# EAGLE design 0132-ledz-8 (EAGLE 9.6.2)
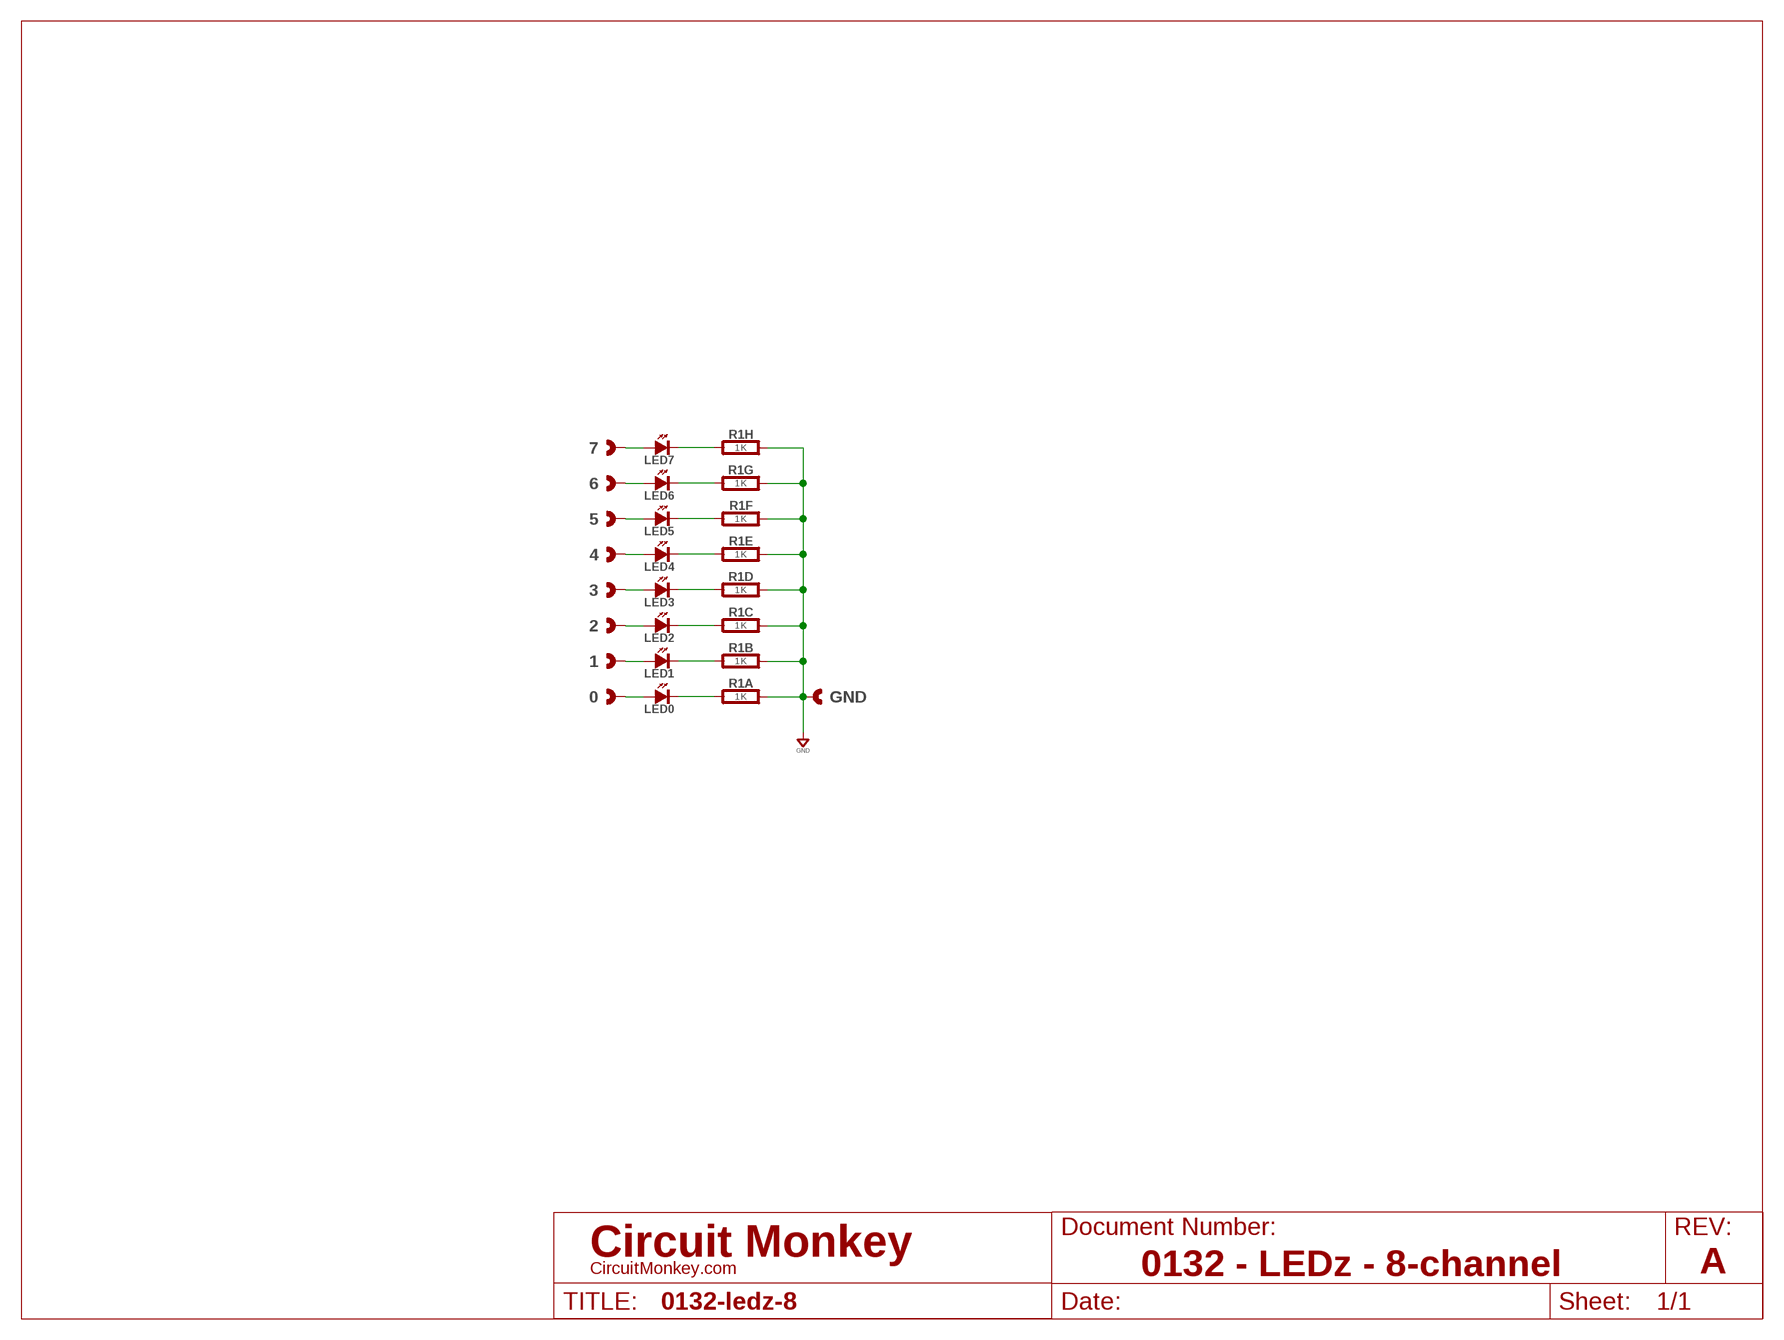
[diagram p0: schematic, sheet 1]
SHEET1 (LETTER_L-CIRCUITMONKEY): DOCUMENT_NUMBER: 0132 - LEDz - 8-channel; REV: A

## Parts
0  CAST-01X12.00MM  [CAST01-2.00MM]
1  CAST-01X12.00MM  [CAST01-2.00MM]
2  CAST-01X12.00MM  [CAST01-2.00MM]
3  CAST-01X12.00MM  [CAST01-2.00MM]
4  CAST-01X12.00MM  [CAST01-2.00MM]
5  CAST-01X12.00MM  [CAST01-2.00MM]
6  CAST-01X12.00MM  [CAST01-2.00MM]
7  CAST-01X12.00MM  [CAST01-2.00MM]
GND  CAST-01X12.00MM  [CAST01-2.00MM]
LED0  SMT0603  [SMD_0603]
LED1  SMT0603  [SMD_0603]
LED2  SMT0603  [SMD_0603]
LED3  SMT0603  [SMD_0603]
LED4  SMT0603  [SMD_0603]
LED5  SMT0603  [SMD_0603]
LED6  SMT0603  [SMD_0603]
LED7  SMT0603  [SMD_0603]
R1  1K  RESNET_0402_INDIV_X8CTS  [RESNET_0402_X8]

## Nets
GND: GND.1 GND.P$1 GND.P$2 R1.1 R1.2 R1.3 R1.4 R1.5 R1.6 R1.7 R1.8
LED0: 0.1 0.P$1 0.P$2 LED0.A
LED1: 1.1 1.P$1 1.P$2 LED1.A
LED2: 2.1 2.P$1 2.P$2 LED2.A
LED3: 3.1 3.P$1 3.P$2 LED3.A
LED4: 4.1 4.P$1 4.P$2 LED4.A
LED5: 5.1 5.P$1 5.P$2 LED5.A
LED6: 6.1 6.P$1 6.P$2 LED6.A
LED7: 7.1 7.P$1 7.P$2 LED7.A
N$1: LED0.K(C) R1.16
N$2: LED1.K(C) R1.15
N$3: LED2.K(C) R1.14
N$4: LED3.K(C) R1.13
N$5: LED4.K(C) R1.12
N$6: LED5.K(C) R1.11
N$7: LED6.K(C) R1.10
N$8: LED7.K(C) R1.9

## Library data of the parts
0 1-7 GND = con-headers:CAST-01X1: Castelated Edge Hole Pad
LED0 LED1-LED7 = led:SMT: LED SMT; COST01: 0.20; COST10: 0.17; COST100: 0.14
R1 = rlc:RESNET_0402_INDIV_X8: Resnet - Network Eight Individual Resistors.; COST01: 0.50; COST10: 0.20; COST100: 0.14; MFR: CTS; MPN: 741X163xxx

## Board
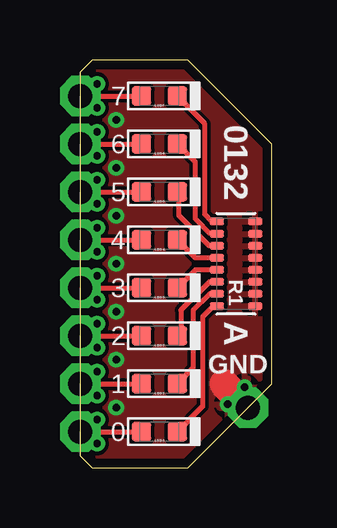
[diagram p1: board, top side]
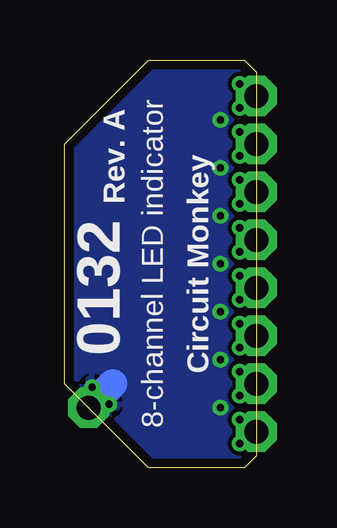
[diagram p2: board, bottom side, seen from below]

Size 8 x 17 mm. Coordinates in mm from the lower left corner, seen from the top.
Outline: 0,0.5 0.5,0 4.5,0 8,3.5 8,13.5 4.5,17 0.5,17 0,16.5 0,0.5
Copper layers (1*16): Top 0.0712mm / dielectric 0.657mm / Bottom 0.0712mm
Design rules "OSH-CircuitMonkey-thin": minimum track width 6mil, minimum drill 12mil, track to track 6mil, track to pad 6mil, pad to pad 6mil, via to via 6mil, smd to smd 6mil, copper to edge 15mil, drill to drill 6mil, minimum pad ring 7mil, minimum via ring 7mil, stop-mask expansion 3mil, vias tented up to drill 14mil, thermal gap 10mil

### Footprints (pad centres in the part's own frame; a part is rotated, then mirrored left to right if it is on the bottom)
CAST01-2.00MM = drill 1 pad 1.7 octagon: 1 0,0 | drill 0.305: P$1 -0.7,0.5; P$2 -0.7,-0.5
SMD_0603 = smd 0.8 x 0.8: A 0.75,0; K -0.75,0
RESNET_0402_X8 = smd 0.6 x 0.325: 1 -0.8,1.765; 8 -0.8,-1.765; 9 0.8,-1.765; 16 0.8,1.765 | smd 0.6 x 0.3: 2 -0.8,1.25; 3 -0.8,0.75; 4 -0.8,0.25; 5 -0.8,-0.25; 6 -0.8,-0.75; 7 -0.8,-1.25; 10 0.8,-1.25; 11 0.8,-0.75; 12 0.8,-0.25; 13 0.8,0.25; 14 0.8,0.75; 15 0.8,1.25

### Placement (x,y rotation side)
0  0,1.5 180 top
1  0,3.5 180 top
2  0,5.5 180 top
3  0,7.5 180 top
4  0,9.5 180 top
5  0,11.5 180 top
6  0,13.5 180 top
7  0,15.5 180 top
GND  7,2.5 315 top
LED0  3.3,1.5 180 top
LED1  3.3,3.5 180 top
LED2  3.3,5.5 180 top
LED3  3.3,7.5 180 top
LED4  3.3,9.5 180 top
LED5  3.3,11.5 180 top
LED6  3.3,13.5 180 top
LED7  3.3,15.5 180 top
R1  6.5,8.5 180 top

### Tracks (layer width: path | path; a pad name or v marks a point on that pad's centre or on a via)
GND  (via drill 0.3)
  Top 0.2: 6.86,2.64 GND.1 6.86,2.64 | 6.86,2.64 GND.P$1 | 6.86,2.64 GND.P$2
  Top 1.2: GND.1 6,3.5
  Bottom 1.2: GND.1 6,3.5
  other vias: 1.5,14.5 1.5,12.5 1.5,10.5 1.5,8.5 1.5,6.5 1.5,4.5 1.5,2.5
  pour Top: 0.5,0 0,0.5 0,16.5 0.5,17 4.5,17 8,13.5 8,3.5 4.5,0
  pour Bottom: 8,3.5 8,13.5 4.5,17 0.5,17 0,16.5 0,0.5 0.5,0 4.5,0
LED0
  Top 0.2: LED0.A 0.1 0.2,1.5 | 0.2,1.5 0.P$1 | 0.2,1.5 0.P$2
LED1
  Top 0.2: LED1.A 1.1 0.2,3.5 | 0.2,3.5 1.P$1 | 0.2,3.5 1.P$2
LED2
  Top 0.2: LED2.A 2.1 0.2,5.5 | 0.2,5.5 2.P$1 | 0.2,5.5 2.P$2
LED3
  Top 0.2: LED3.A 3.1 0.2,7.5 | 0.2,7.5 3.P$2 | 0.2,7.5 3.P$1
LED4
  Top 0.2: LED4.A 4.1 0.2,9.5 | 0.2,9.5 4.P$2 | 0.2,9.5 4.P$1
LED5
  Top 0.2: LED5.A 5.1 0.2,11.5 | 0.2,11.5 5.P$2 | 0.2,11.5 5.P$1
LED6
  Top 0.2: LED6.A 6.1 0.2,13.5 | 0.2,13.5 6.P$2 | 0.2,13.5 6.P$1
LED7
  Top 0.2: LED7.A 7.1 0.2,15.5 | 0.2,15.5 7.P$1 | 0.2,15.5 7.P$2
N$1
  Top 0.2: R1.16 5.55,6.74 5.1,6.29 5.1,2.55 LED0.K
N$2
  Top 0.2: R1.15 5.4,7.25 4.7,6.55 4.7,4.17 4.05,3.51 LED1.K
N$3
  Top 0.2: R1.14 5.39,7.75 4.2,6.56 4.2,5.65 LED2.K
N$4
  Top 0.2: R1.13 4.8,8.25 LED3.K
N$5
  Top 0.2: R1.12 4.8,8.75 LED4.K
N$6
  Top 0.2: R1.11 5.39,9.25 4.1,10.54 4.1,11.45 LED5.K
N$7
  Top 0.2: R1.10 5.43,9.75 4.8,10.38 4.8,12.75 LED6.K
N$8
  Top 0.2: R1.9 5.5,10.27 5.2,10.56 5.2,14.34 4.05,15.49 LED7.K

### Text on the board
tPlace: 0132 | A
bPlace: Rev. A | Circuit Monkey | 8-channel LED indicator | 0132